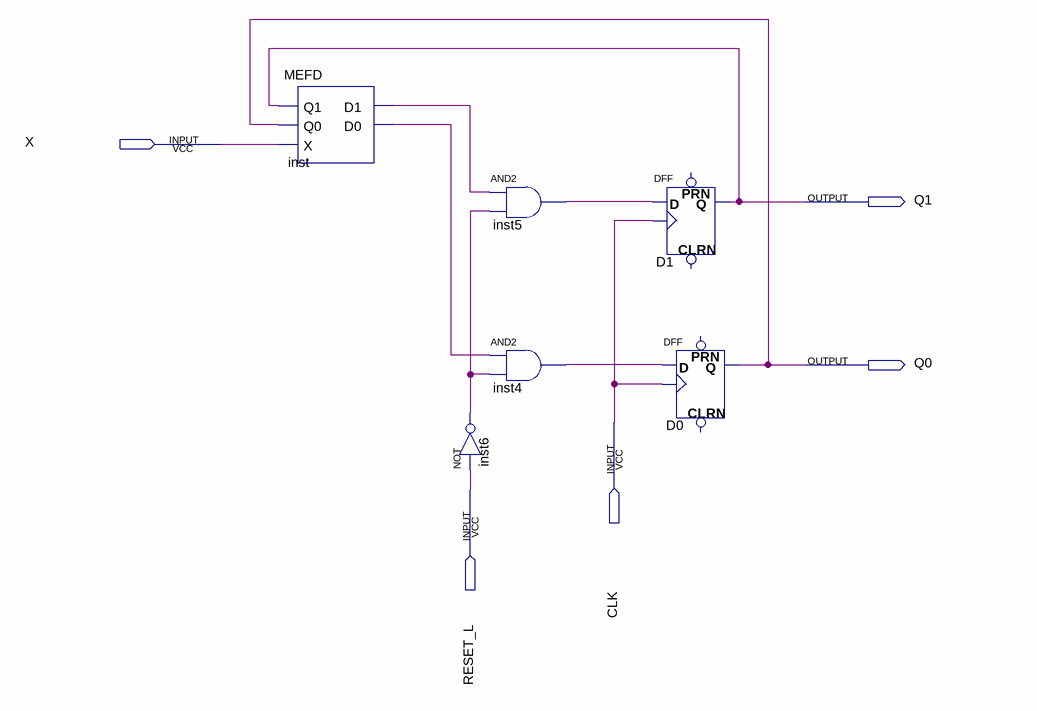
[diagram p0: schematic sheet]
// Quartus schematic MEF1.bdf as structural Verilog: 6 symbols, 5 pins
module MEF1 (
  input  X,
  input  CLK,
  input  RESET_L,
  output Q1,
  output Q0
);

  wire inst4_out, inst5_out, inst6_out, inst_d0, inst_d1;

  MEFD inst (.Q1(Q1), .Q0(Q0), .X(X), .D1(inst_d1), .D0(inst_d0));
  not inst6 (inst6_out, RESET_L);
  and inst5 (inst5_out, inst_d1, inst6_out);
  and inst4 (inst4_out, inst_d0, inst6_out);
  DFF D1 (.CLK(CLK), .D(inst5_out), .Q(Q1));  // open: CLRN, PRN
  DFF D0 (.CLK(CLK), .D(inst4_out), .Q(Q0));  // open: CLRN, PRN
endmodule
